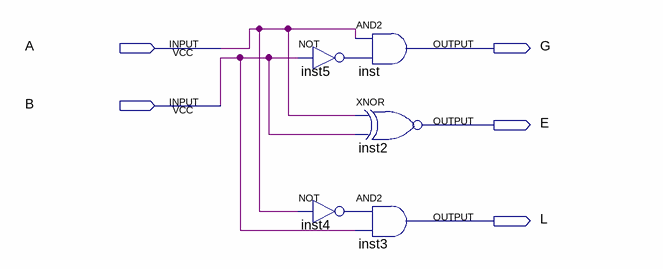
[diagram p0: schematic sheet]
// Quartus schematic 1101-2.bdf as structural Verilog: 5 symbols, 5 pins
module \1101-2  (
  input  A,
  input  B,
  output G,
  output E,
  output L
);

  wire inst4_out, inst5_out;

  not inst5 (inst5_out, B);
  not inst4 (inst4_out, A);
  and inst (G, A, inst5_out);
  xnor inst2 (E, A, B);
  and inst3 (L, inst4_out, B);
endmodule
